# EAGLE schematic lungmate (EAGLE 5.06)
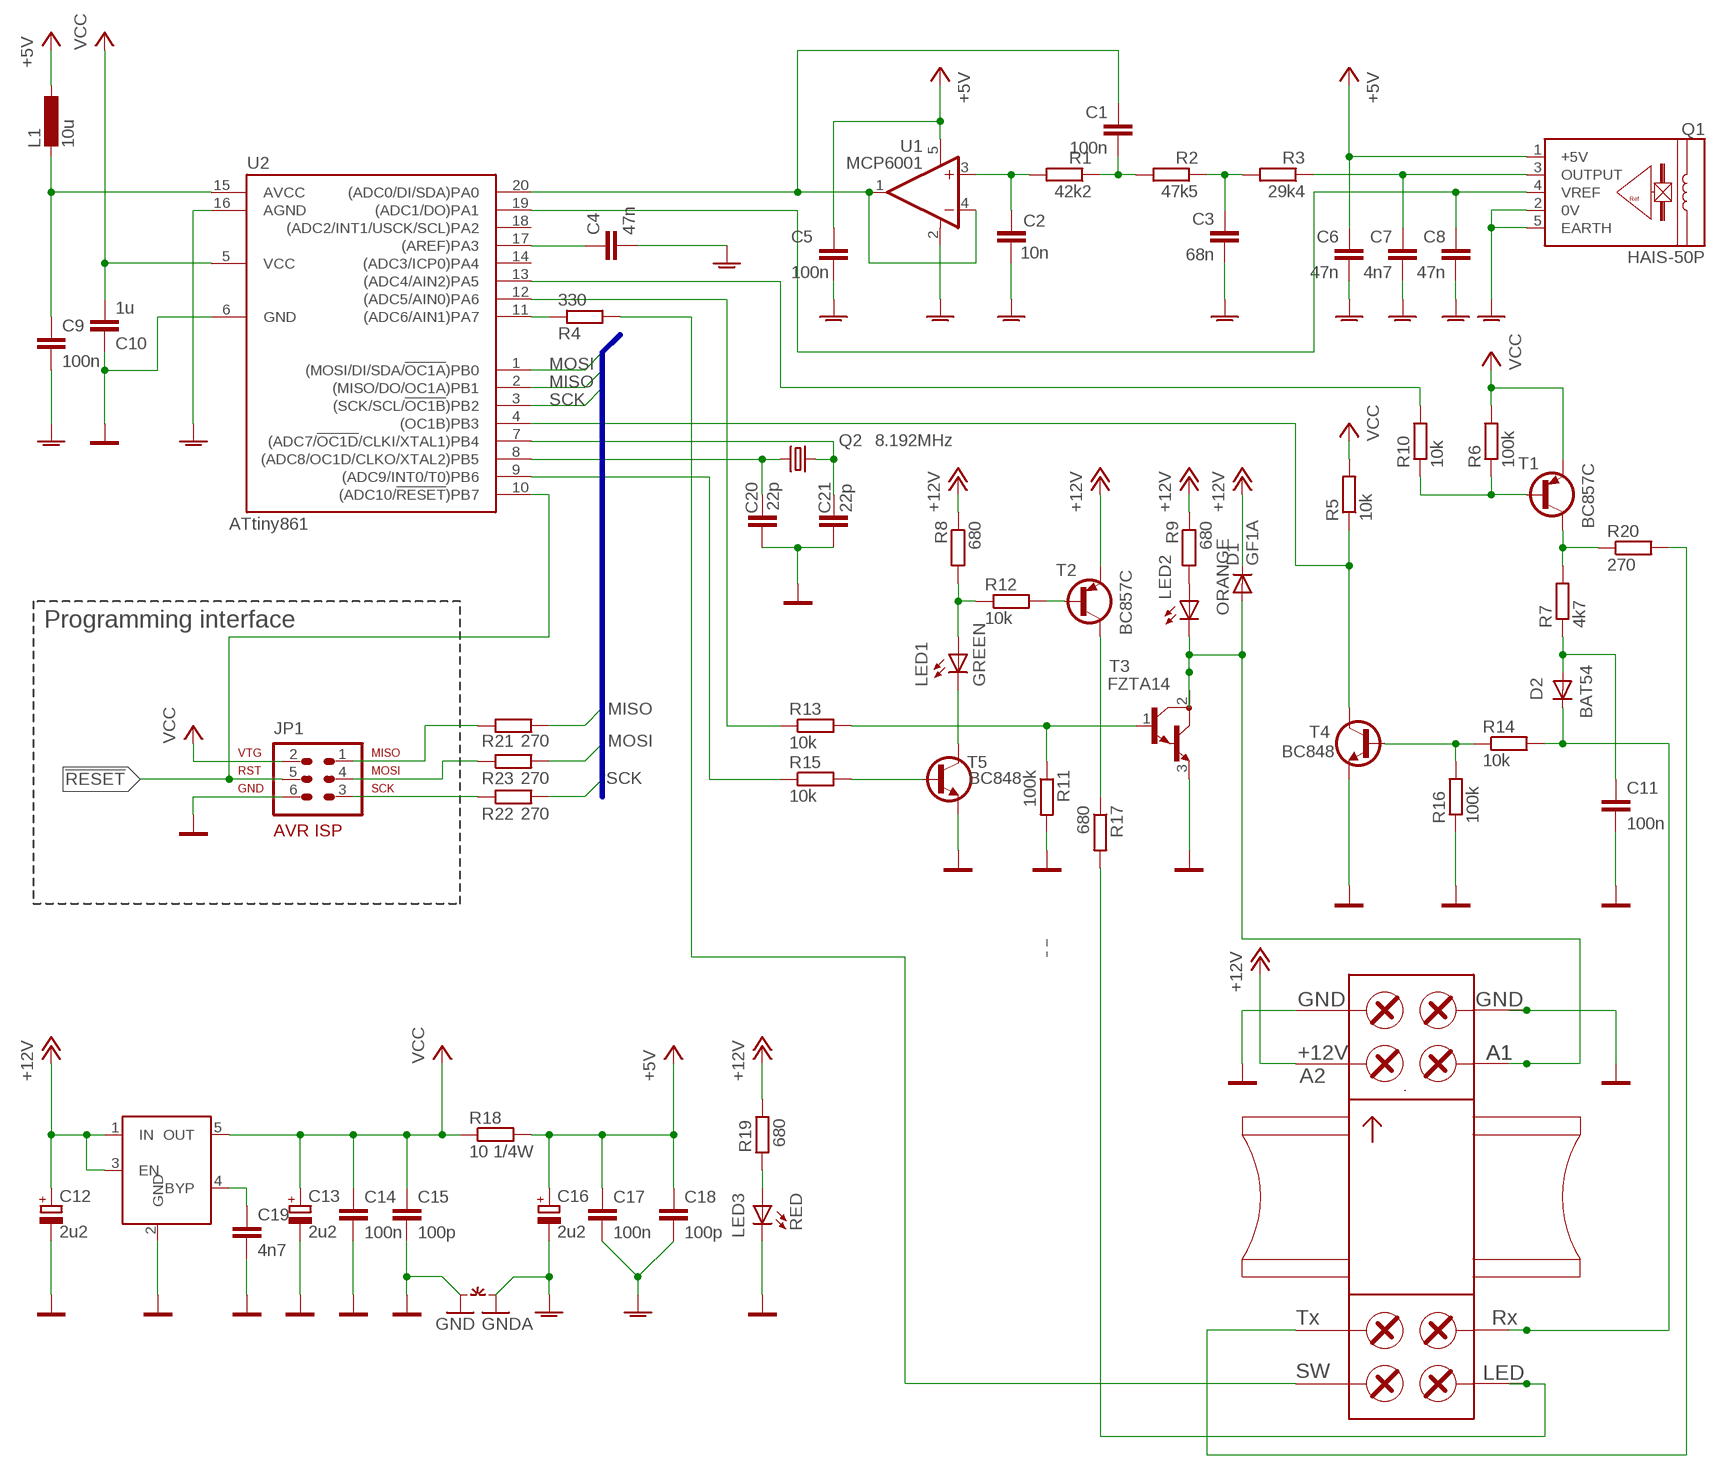
[diagram p0: schematic, sheet 1]

## Parts
C1  100n  C-EUC0603K  [C0603K]
C2  10n  C-EUC0603K  [C0603K]
C3  68n  C-EUC0603K  [C0603K]
C4  47n  C-EUC0603K  [C0603K]
C5  100n  C-EUC0603K  [C0603K]
C6  47n  C-EUC0603K  [C0603K]
C7  4n7  C-EUC0603K  [C0603K]
C8  47n  C-EUC0603K  [C0603K]
C9  100n  C-EUC0603K  [C0603K]
C10  1u  C-EUC0603K  [C0603K]
C11  100n  C-EUC0603K  [C0603K]
C12  2u2  CPOL-EUSMCA  [SMC_A]
C13  2u2  CPOL-EUSMCA  [SMC_A]
C14  100n  C-EUC0603K  [C0603K]
C15  100p  C-EUC0603K  [C0603K]
C16  2u2  CPOL-EUSMCA  [SMC_A]
C17  100n  C-EUC0603K  [C0603K]
C18  100p  C-EUC0603K  [C0603K]
C19  4n7  C-EUC0603K  [C0603K]
C20  22p  C-EUC0603K  [C0603K]
C21  22p  C-EUC0603K  [C0603K]
D1  GF1A  DIODE-DO214AA  [DO214AA]
D2  BAT54  DIODE-SOD123  [SOD123]
JP1  AVR-ISP-6  [AVR-ISP-6]
K2  91.201S  [91.201]
L1  10u  L-EUL1210  [C1210K]
LED1  GREEN  LEDH13X  [H13X]
LED2  ORANGE  LEDH13X  [H13X]
LED3  RED  LEDH13X  [H13X]
Q1  HAIS-50P  HAIS  [HAIS-P]
Q2  8.192MHz  CRYSTALHC49UP  [HC49UP]
R1  42k2  R-EU_R0603  [R0603]
R2  47k5  R-EU_R0603  [R0603]
R3  29k4  R-EU_R0603  [R0603]
R4  330  R-EU_R0603  [R0603]
R5  10k  R-EU_R0603  [R0603]
R6  100k  R-EU_R0603  [R0603]
R7  4k7  R-EU_R0603  [R0603]
R8  680  R-EU_R1206  [R1206]
R9  680  R-EU_R1206  [R1206]
R10  10k  R-EU_R0603  [R0603]
R11  100k  R-EU_R0603  [R0603]
R12  10k  R-EU_R0603  [R0603]
R13  10k  R-EU_R0603  [R0603]
R14  10k  R-EU_R0603  [R0603]
R15  10k  R-EU_R0603  [R0603]
R16  100k  R-EU_R0603  [R0603]
R17  680  R-EU_R1206  [R1206]
R18  10 1/4W  R-EU_R1210  [R1210]
R19  680  R-EU_R1206  [R1206]
R20  270  R-EU_R0603  [R0603]
R21  270  R-EU_R0603  [R0603]
R22  270  R-EU_R0603  [R0603]
R23  270  R-EU_R0603  [R0603]
T1  BC857C  BC857ALT1SMD  [SOT23-BEC]
T2  BC857C  BC857ALT1SMD  [SOT23-BEC]
T3  FZTA14  [SOT223]
T4  BC848  [SOT23]
T5  BC848  [SOT23]
U1  MCP6001  OPA340N  [SOT23-5]
U2  ATtiny861  ATTINY61TINY861-20SU  [SOIC20S]
U3  MIC5205U  [SOT23-5]
~NUDEV~  GND-GNDA  [GND-GNDA]

## Nets
!RESET: JP1.5 U2.10((ADC10/!RESET!)PB7)
+5V: C5.1 C6.1 C16.+ C17.1 C18.1 L1.1 Q1.1(+5V) R18.2 U1.5(V+)
+12V: C12.+ D1.C K2.R2.1 R8.1 R9.1 R19.1 T2.E U3.1(IN) U3.3(EN)
CS_REF: C8.1 Q1.4(VREF) U2.19((ADC1/DO)PA1)
DATA_IN: R10.2 U2.13((ADC4/AIN2)PA5)
DATA_OUT: R5.1 T4.3(C) U2.4((OC1B)PB3)
EXT_LED: K2.R4.2@1(R4.2) K2.R4.2@2(R4.2) R17.2
EXT_SW: K2.R4.1 R4.2
FILTERED_SIGNAL: C1.1 U1.1(OUT) U1.4(-IN) U2.20((ADC0/DI/SDA)PA0)
GND: C10.1 C11.2 C12.- C13.- C14.2 C15.2 C19.2 C20.1 C21.1 JP1.6 K2.R1.1 K2.R1.2@1(R1.2) K2.R1.2@2(R1.2) LED3.K(C) R11.2 R16.1 T3.3(E) T4.2(E) T5.2(E) U2.6(GND) U3.2(GND) ~NUDEV~.GND
GNDA: C2.2 C3.2 C4.2 C5.2 C6.2 C7.2 C8.2 C9.2 C16.- C17.2 C18.2 Q1.2(0V) Q1.5(EARTH) U1.2(V-) U2.16(AGND) ~NUDEV~.GNDA
MISO: R21.2 U2.2((MISO/DO/OC1A)PB1)
MOSI: R23.2 U2.1((MOSI/DI/SDA/!OC1A!)PB0)
N$1: C20.2 Q2.2 U2.8((ADC8/OC1D/CLKO/XTAL2)PB5)
N$2: C11.1 D2.A R7.1
N$3: R6.1 R10.1 T1.B
N$4: C7.1 Q1.3(OUTPUT) R3.1
N$5: JP1.1 R21.1
N$6: C3.1 R2.1 R3.2
N$7: C1.2 R1.1 R2.2
N$8: C2.1 R1.2 U1.3(+IN)
N$9: C9.1 L1.2 U2.15(AVCC)
N$10: R17.1 T2.C
N$11: C4.1 U2.17((AREF)PA3)
N$12: LED3.A R19.2
N$13: R15.2 T5.1(B)
N$14: R12.2 T2.B
N$16: LED1.A R8.2 R12.1
N$17: R15.1 U2.9((ADC9/INT0/T0)PB6)
N$18: R14.1 R16.2 T4.1(B)
N$19: R4.1 U2.11((ADC6/AIN1)PA7)
N$20: C21.2 Q2.1 U2.7((ADC7/!OC1D!/CLKI/XTAL1)PB4)
N$21: LED2.A R9.2
N$22: C19.1 U3.4(BYP)
N$23: R13.1 U2.12((ADC5/AIN0)PA6)
N$24: JP1.4 R23.1
N$25: LED1.K(C) T5.3(C)
N$26: JP1.3 R22.1
N$27: R7.2 R20.1 T1.C
RELAY_COIL: D1.A K2.R2.2@1(R2.2) K2.R2.2@2(R2.2) LED2.K(C) T3.2(C) T3.4(C)
RELAY_CTRL: R11.1 R13.2 T3.1(B)
SCK: R22.2 U2.3((SCK/SCL/!OC1B!)PB2)
SERIAL_IN: D2.C K2.R3.2@1(R3.2) K2.R3.2@2(R3.2) R14.2
SERIAL_OUT: K2.R3.1 R20.2
VCC: C10.2 C13.+ C14.1 C15.1 JP1.2 R5.2 R6.2 R18.1 T1.E U2.5(VCC) U3.5(OUT)
Unconnected: U2.14((ADC3/ICP0)PA4) U2.18((ADC2/INT1/USCK/SCL)PA2)

## Buses
MISO,MOSI,SCK

## Notes on the sheet
- Programming interface
- GND | GND
- +12V | A1 | A1
- A2
- Tx | Rx
- SW | LED

## Library data of the parts
C1-C11 C14 C15 C17-C21 = rcl:C-EU: CAPACITOR, European symbol
C12 C13 C16 = rcl:CPOL-EU: POLARIZED CAPACITOR, European symbol
D1 D2 = diode:DIODE-: DIODE
JP1 = avr-4:AVR-ISP-6: AVR ISP-6 Serial Programming Header
K2 = altech:91.201S
L1 = rcl:L-EU: INDUCTOR, European symbol
LED1-LED3 = led:LED: LED OSRAM: - CHIPLED LG R971, LG N971, LY N971, LG Q971, LY Q971, LO R971, LY R971 LH N974, LH R974 LS Q976, LO Q976, LY Q976 LO Q996 - Hyper CHIPLED LW Q18S LB Q993, LB Q99A, LB R99A - SideLED LS A670, LO A670, LY A670, LG A670, LP A670 LB A673, LV A673, LT A673, LW A673 LH A674 LY A675 LS A676, LA A676, LO A676, LY A676, LW A676 LS A679, LY A679, LG A679 - Hyper Micro SIDELED® LS Y876, LA Y876, LO Y876, LY Y876 LT Y87S - SmartLED LW L88C, LW L88S LB L89C, LB L89S, LG L890 LS L89K, LO L89K, LY L89K LS L896, LA L896, LO L896, LY L896 - TOPLED LS T670, LO T670, LY T670, LG T670, LP T670 LSG T670, LSP T670, LSY T670, LOP T670, LYG T670 LG T671, LOG T671, LSG T671 LB T673, LV T673, LT T673, LW T673 LH T674 LS T676, LA T676, LO T676, LY T676, LB T676, LH T676, LSB T676, LW T676 LB T67C, LV T67C, LT T67C, LS T67K, LO T67K, LY T67K, LW E67C LS E67B, LA E67B, LO E67B, LY E67B, LB E67C, LV E67C, LT E67C LW T67C LS T679, LY T679, LG T679 LS T770, LO T770, LY T770, LG T770, LP T770 LB T773, LV T773, LT T773, LW T773 LH T774 LS E675, LA E675, LY E675, LS T675 LS T776, LA T776, LO T776, LY T776, LB T776 LHGB T686 LT T68C, LB T68C - Hyper Mini TOPLED® LB M676 - Mini TOPLED Santana® LG M470 LS M47K, LO M47K, LY M47K Source: http://www.osram.convergy.de/
Q1 = lem:HAIS
Q2 = crystal:CRYSTAL: CRYSTAL
R1-R23 = rcl:R-EU_: RESISTOR, European symbol
T1 T2 = transistor-pnp:BC857*: PNP Transistror
T3 = transistor:FZTA14
T4 T5 = transistor:BC848: NPN TRANSISTOR
U1 = burr-brown:OPA340: Rail-to-Rail Operational Amplifiers Single-Supply, MicroAmplifier(TM) Series
U2 = avr-4:ATTINY*61
U3 = micrel:MIC5205
~NUDEV~ = supply1:GND-GNDA: Example of GND--GNDA NET-Connetor for more info see description in package